# Altium schematic sheet Project_Information.SchDoc: =project_title
size Tabloid; CompanyName: Luxonis Holding; Organization: Luxonis Holding; Address1: 1925 Harmony Park Drive; Address2: Westminster, CO; Address3: 80234; Address4: United States; SheetNumber: 2; SheetTotal: 12
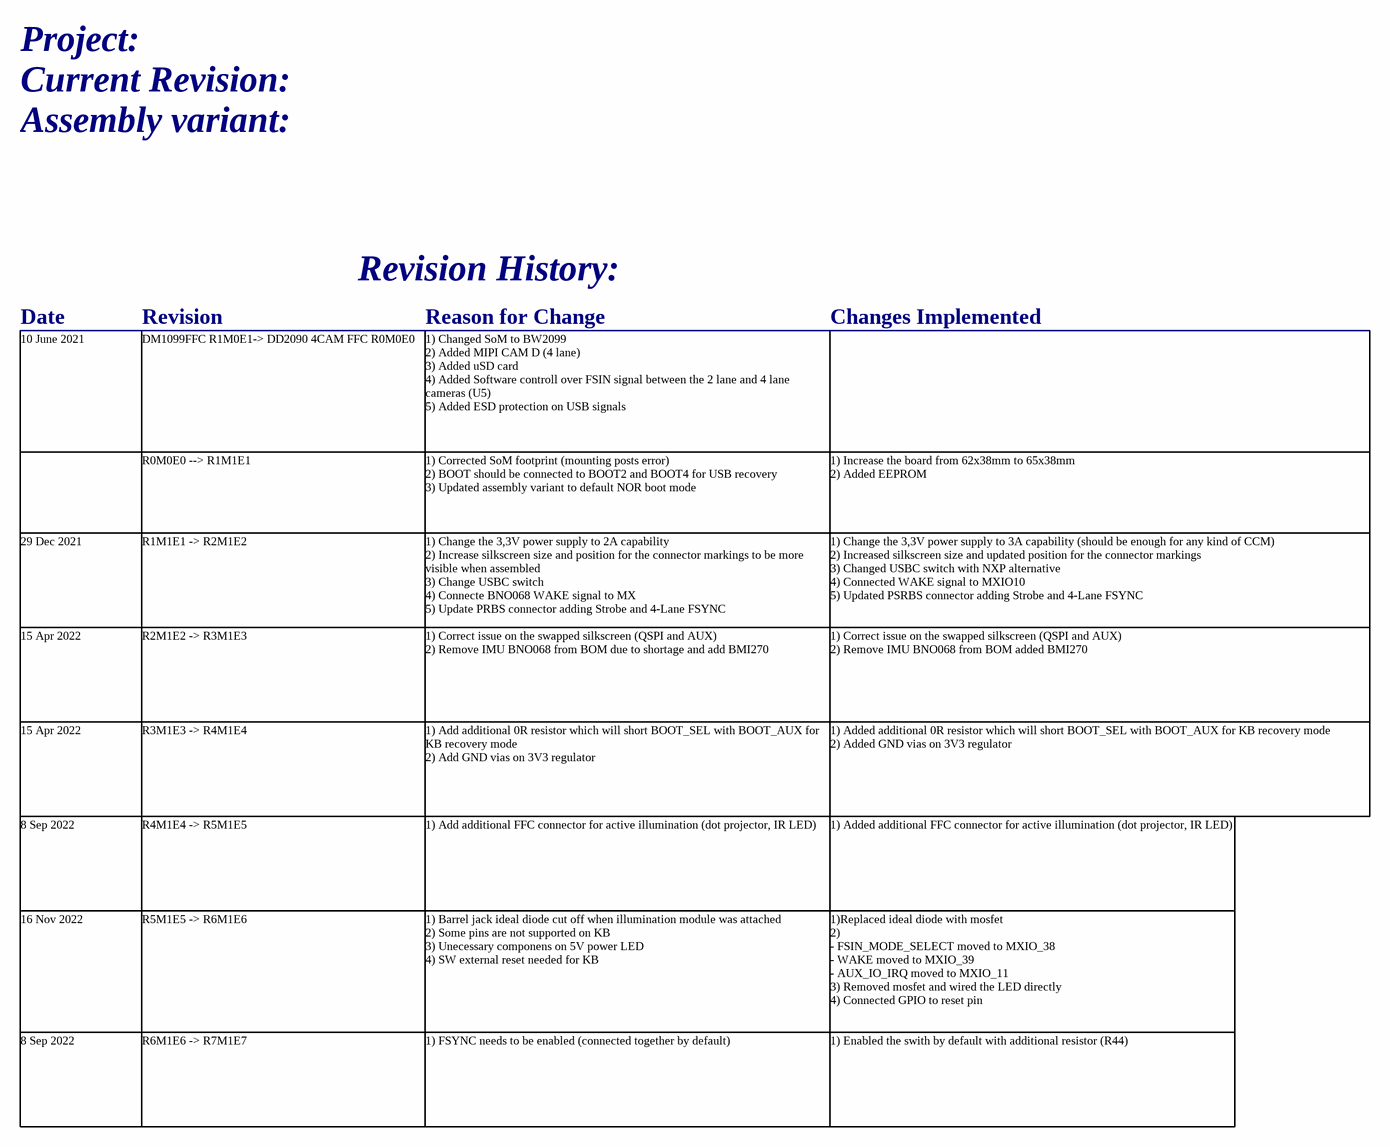
[diagram p0: Project_Information.SchDoc]

## Notes on the sheet
- Project:
- Current Revision:
- Assembly variant:
- Revision History:
- Date
- Revision
- Reason for Change
- Changes Implemented
- 10 June 2021
- DM1099FFC R1M0E1-> DD2090 4CAM FFC R0M0E0
- 1) Changed SoM to BW2099
  2) Added MIPI CAM D (4 lane)
  3) Added uSD card
  4) Added Software controll over FSIN signal between the 2 lane and 4 lane cameras (U5)
  5) Added ESD protection on USB signals
- R0M0E0 --> R1M1E1
- 1) Corrected SoM footprint (mounting posts error)
  2) BOOT should be connected to BOOT2 and BOOT4 for USB recovery
  3) Updated assembly variant to default NOR boot mode
- 1) Increase the board from 62x38mm to 65x38mm
  2) Added EEPROM
- 29 Dec 2021
- R1M1E1 -> R2M1E2
- 1) Change the 3,3V power supply to 2A capability
  2) Increase silkscreen size and position for the connector markings to be more visible when assembled
  3) Change USBC switch
  4) Connecte BNO068 WAKE signal to MX
  5) Update PRBS connector adding Strobe and 4-Lane FSYNC
- 1) Change the 3,3V power supply to 3A capability (should be enough for any kind of CCM)
  2) Increased silkscreen size and updated position for the connector markings
  3) Changed USBC switch with NXP alternative
  4) Connected WAKE signal to MXIO10
  5) Updated PSRBS connector adding Strobe and 4-Lane FSYNC
- 15 Apr 2022
- R2M1E2 -> R3M1E3
- 1) Correct issue on the swapped silkscreen (QSPI and AUX)
  2) Remove IMU BNO068 from BOM due to shortage and add BMI270
- 1) Correct issue on the swapped silkscreen (QSPI and AUX)
  2) Remove IMU BNO068 from BOM added BMI270
- R3M1E3 -> R4M1E4
- 1) Add additional 0R resistor which will short BOOT_SEL with BOOT_AUX for KB recovery mode
  2) Add GND vias on 3V3 regulator
- 1) Added additional 0R resistor which will short BOOT_SEL with BOOT_AUX for KB recovery mode
  2) Added GND vias on 3V3 regulator
- 8 Sep 2022
- R4M1E4 -> R5M1E5
- 1) Add additional FFC connector for active illumination (dot projector, IR LED)
- 1) Added additional FFC connector for active illumination (dot projector, IR LED)
- 16 Nov 2022
- R5M1E5 -> R6M1E6
- 1) Barrel jack ideal diode cut off when illumination module was attached
  2) Some pins are not supported on KB
  3) Unecessary componens on 5V power LED
  4) SW external reset needed for KB
- 1)Replaced ideal diode with mosfet
  2)
  - FSIN_MODE_SELECT moved to MXIO_38
  - WAKE moved to MXIO_39
  - AUX_IO_IRQ moved to MXIO_11
  3) Removed mosfet and wired the LED directly
  4) Connected GPIO to reset pin
- R6M1E6 -> R7M1E7
- 1) FSYNC needs to be enabled (connected together by default)
- 1) Enabled the swith by default with additional resistor (R44)
- Title
- Size:
- Date:
- Tabloid
- Number:
- Time:
- Revision:
- Sheet
- of
- Drawn by: